# EAGLE design ublisterred_vow (EAGLE 9.6.2)
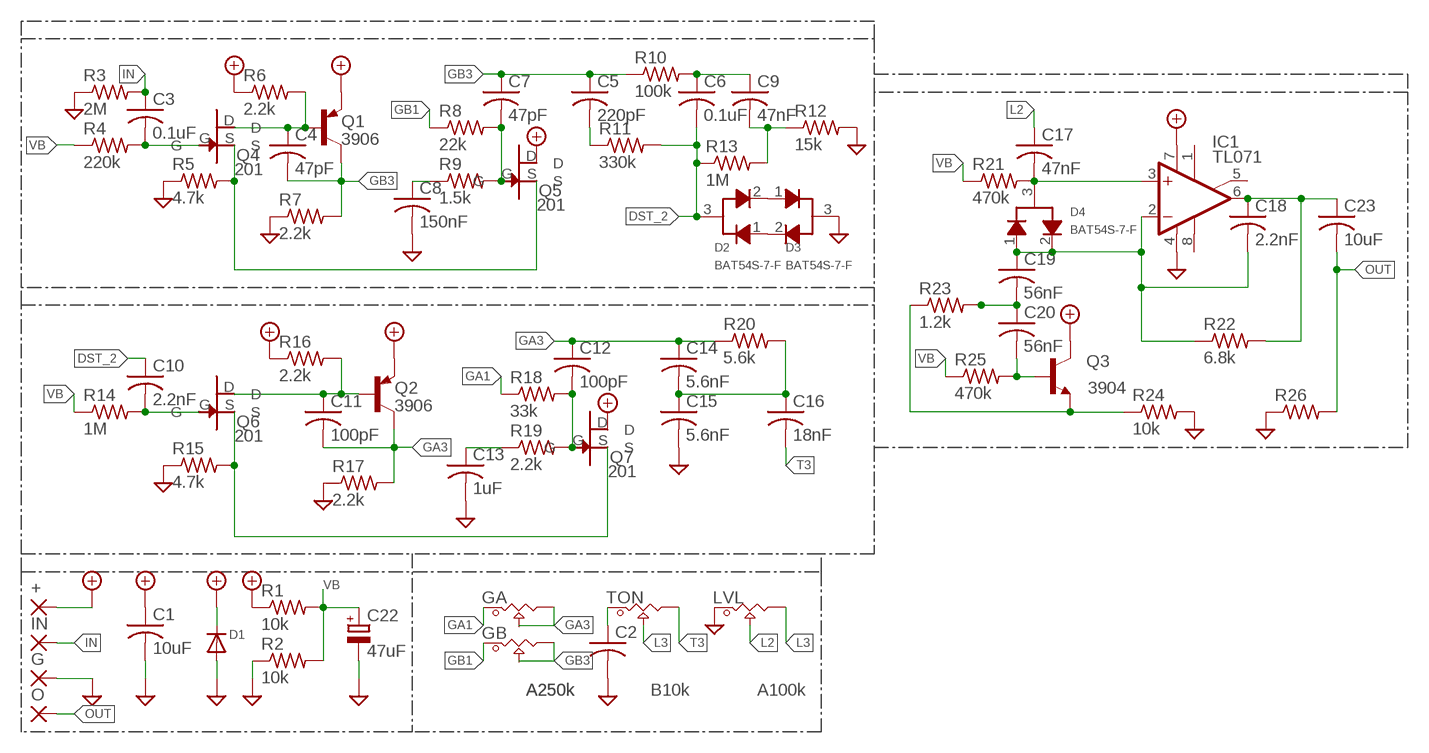
[diagram p0: schematic, sheet 1]

## Parts
+  SMD2  [SMD1,27-2,54]
C1  10uF  C-USC1206  [C1206]
C2  C-USC0603  [C0603]
C3  0.1uF  C-USC0603  [C0603]
C4  47pF  C-USC0603  [C0603]
C5  220pF  C-USC0603  [C0603]
C6  0.1uF  C-USC0603  [C0603]
C7  47pF  C-USC0603  [C0603]
C8  150nF  C-USC0603  [C0603]
C9  47nF  C-USC0603  [C0603]
C10  2.2nF  C-USC0603  [C0603]
C11  100pF  C-USC0603  [C0603]
C12  100pF  C-USC0603  [C0603]
C13  1uF  C-USC0603  [C0603]
C14  5.6nF  C-USC0603  [C0603]
C15  5.6nF  C-USC0603  [C0603]
C16  18nF  C-USC0603  [C0603]
C17  47nF  C-USC0603  [C0603]
C18  2.2nF  C-USC0603  [C0603]
C19  56nF  C-USC0603  [C0603]
C20  56nF  C-USC0603  [C0603]
C22  47uF  C-POL_TANTALUM-2917(7343-METRIC)  [CAPMP7343X310N]
C23  10uF  C-USC1206  [C1206]
D1  DIODESOD-123  [SOD-123]
D2  BAT54S-7-F  [SOT23-3]
D3  BAT54S-7-F  [SOT23-3]
D4  BAT54S-7-F  [SOT23-3]
G  SMD2  [SMD1,27-2,54]
GA  A250k  POT_9MM_SMD  [POT_9MM_SMD]
GB  A250k  POT_9MM_SMD  [POT_9MM_SMD]
IC1  TL071  TL071D  [SO08]
IN  SMD2  [SMD1,27-2,54]
LVL  A100k  POT_9MM_SMD  [POT_9MM_SMD]
O  SMD2  [SMD1,27-2,54]
Q1  3906  MMBT3906LT1G  [SOT23-3]
Q2  3906  MMBT3906LT1G  [SOT23-3]
Q3  3904  MMBT3904LT1G  [SOT23-3]
Q4  201  MMBFJ201  [MMBFJ201]
Q5  201  MMBFJ201  [MMBFJ201]
Q6  201  MMBFJ201  [MMBFJ201]
Q7  201  MMBFJ201  [MMBFJ201]
R1  10k  R-US_R0603  [R0603]
R2  10k  R-US_R0603  [R0603]
R3  2M  R-US_R0603  [R0603]
R4  220k  R-US_R0603  [R0603]
R5  4.7k  R-US_R0603  [R0603]
R6  2.2k  R-US_R0603  [R0603]
R7  2.2k  R-US_R0603  [R0603]
R8  22k  R-US_R0603  [R0603]
R9  1.5k  R-US_R0603  [R0603]
R10  100k  R-US_R0603  [R0603]
R11  330k  R-US_R0603  [R0603]
R12  15k  R-US_R0603  [R0603]
R13  1M  R-US_R0603  [R0603]
R14  1M  R-US_R0603  [R0603]
R15  4.7k  R-US_R0603  [R0603]
R16  2.2k  R-US_R0603  [R0603]
R17  2.2k  R-US_R0603  [R0603]
R18  33k  R-US_R0603  [R0603]
R19  2.2k  R-US_R0603  [R0603]
R20  5.6k  R-US_R0603  [R0603]
R21  470k  R-US_R0603  [R0603]
R22  6.8k  R-US_R0603  [R0603]
R23  1.2k  R-US_R0603  [R0603]
R24  10k  R-US_R0603  [R0603]
R25  470k  R-US_R0603  [R0603]
R26  R-US_R0603  [R0603]
TON  B10k  POT_9MM_SMD  [POT_9MM_SMD]

## Nets
+9V: +.1(P) C1.1 D1.C IC1.7(V+) Q1.2(E) Q2.2(E) Q3.3(C) Q5.D Q7.D R1.1 R6.1 R16.1
DST_2: C6.2 C10.1 D2.3 R11.2 R13.1
GA1: GA.1 R18.1
GA3: C11.2 C12.1 C14.1 GA.2 GA.3 Q2.3(C) R17.2 R20.1
GB1: GB.1 R8.1
GB3: C4.2 C5.1 C7.1 GB.2 GB.3 Q1.3(C) R7.2 R10.1
GND: C1.2 C2.2 C8.2 C13.2 C15.2 C22.2(-) D1.A D3.3 G.1(P) IC1.4(V-) LVL.1 R2.1 R3.1 R5.1 R7.1 R12.2 R15.1 R17.1 R24.2 R26.1
IN: C3.1 IN.1(P) R3.2
L2: C17.1 LVL.2
L3: LVL.3 TON.2
N$1: C4.1 Q1.1(B) Q4.D R6.2
N$2: C3.2 Q4.G R4.2
N$3: Q4.S Q5.S R5.2
N$4: C7.2 Q5.G R8.2 R9.2
N$5: C2.1 TON.1
N$6: C8.1 R9.1
N$7: C5.2 R11.1
N$8: C6.1 C9.1 R10.2
N$9: C10.2 Q6.G R14.2
N$10: C9.2 R12.1 R13.2
N$11: D2.2 D3.1
N$12: D2.1 D3.2
N$13: Q6.S Q7.S R15.2
N$14: C11.1 Q2.1(B) Q6.D R16.2
N$15: C12.2 Q7.G R18.2 R19.2
N$16: C13.1 R19.1
N$17: C14.2 C15.1 C16.1 R20.2
N$18: C17.2 D4.3 IC1.3(+IN) R21.2
N$19: C18.2 C19.1 D4.1 D4.2 IC1.2(-IN) R22.1
N$20: C18.1 C23.1 IC1.6(OUT) R22.2
N$21: C19.2 C20.1 R23.2
N$22: C20.2 Q3.1(B) R25.2
N$23: Q3.2(E) R23.1 R24.1
OUT: C23.2 O.1(P) R26.2
T3: C16.2 TON.3
VB: C22.1(+) R1.2 R2.2 R4.1 R14.1 R21.1 R25.1
Unconnected: IC1.1(ON1) IC1.5(ON2) IC1.8(OPT)

## Library data of the parts
+ G IN O = wirepad:SMD2: SMD PAD
C1-C20 C23 = adafruit:C-US: CAPACITOR, American symbol
C22 = Capacitor:C-POL: Capacitor Polarised - Generic; CATEGORY: Capacitor
D1 = adafruit:DIODE: Diode SMADIODE - SMA Surface Mount Package 20V 1A Schottky Diode Digikey: 641-1014-6-ND DO-1N4148 - Through Hole Small Current Diode SOD-123 20V 1 A (.5mV Vf) Schottky Diode - Digikey: MBRX120TPMSCT-ND SOD-323 10V 570mA (.38mV Vf, 3ns) Schottky Diode - Digikey: ZLLS410CT-ND SOD-523 30V 30mA Schottky Diode (RB751S-40TE61) - Digikey: RB751S-40TE61CT-ND SOT23-R/W - SOT23 Package (R = Solder Paste/Reflow Ovens, W = Hand-Soldering) BAT54Film 40V 300mA - Digikey: 497-7162-1-ND
D2-D4 = Diodes:BAT54S-7-F: DIODE ARRAY SCHOTTKY 30V SOT23-3 Manufacturer's datasheet <https://www.diodes.com/assets/Datasheets/ds11005.pdf>; CREATED_BY: PCBLayout.com; DIGIKEY_PART_NUMBER: BAT54S-FDITR-ND; MANUFACTURER: Diodes Incorporated; MPN: BAT54S-7-F; PACKAGE: SOT-23
GA GB LVL TON = Potentiometers_SMD:POT_9MM_SMD
IC1 = linear:TL071: OP AMP
Q1 Q2 = Transistor:MMBT3906LT1G: TRANS PNP 40V 0.2A SOT23 Manufacturer's datasheet <https://www.onsemi.com/pub/Collateral/MMBT3906LT1-D.PDF>; CREATED_BY: PCBLayout.com; DIGIKEY_PART_NUMER: MMBT3906LT1GOSTR-ND; MANUFACTURER: ON Semiconductor; MPN: MMBT3906LT1G; PACKAGE: SOT-23
Q3 = Transistor:MMBT3904LT1G: TRANS NPN 40V 0.2A SOT23 Manufacturer's datasheet <https://www.onsemi.com/pub/Collateral/MMBT3904LT1-D.PDF>; CREATED_BY: PCBLayout.com; DIGIKEY_PART_NUMBER: MMBT3904LT1GOSTR-ND; MANUFACTURER: ON Semiconductor; MPN: MMBT3904LT1G; PACKAGE: SOT23-3
Q4-Q7 = SOT95P240X110-3N:MMBFJ201
R1-R26 = adafruit:R-US_: RESISTOR, American symbol

## Board
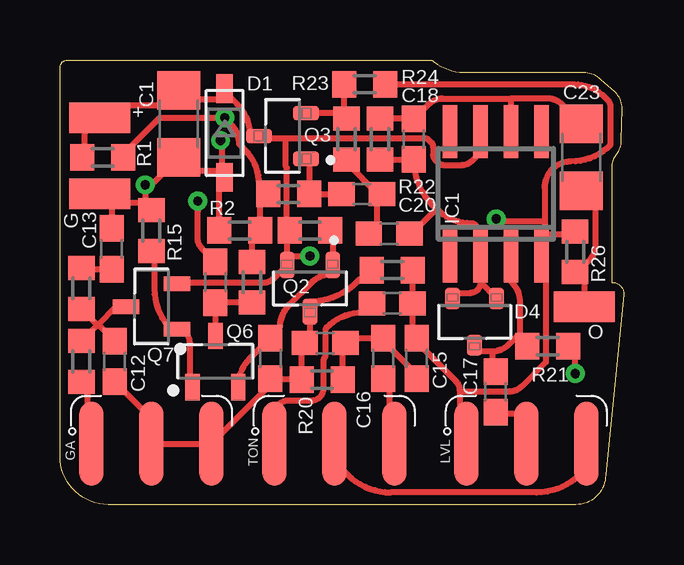
[diagram p1: board, top side]
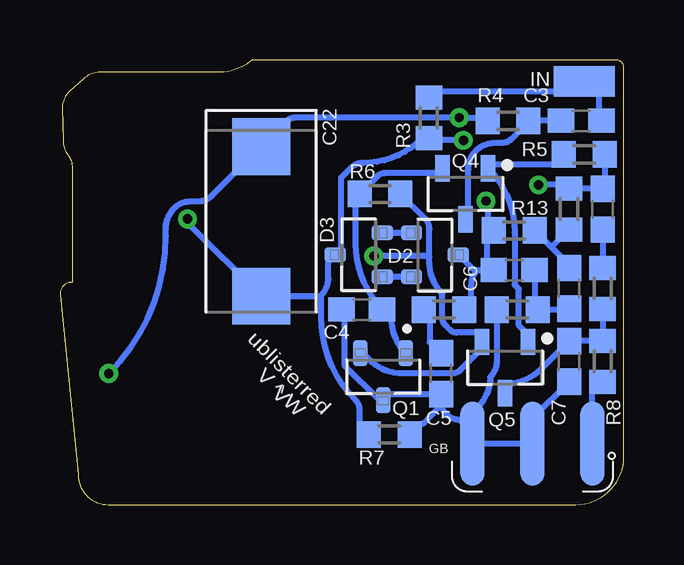
[diagram p2: board, bottom side, seen from below]

Size 23.5 x 18.54 mm. Coordinates in mm from the lower left corner, seen from the top.
Outline: 22.99,9.27 arc-90 23.5,8.76 22.73,1.24 arc-90 21.5,0 2,0 arc-90 0,2 0,18.22 arc-90 0.32,18.54 15.38,18.54 arc-39 15.58,18.47 arc39 16.83,18.03 21.81,18.03 arc-45 22.52,17.74 23.11,17.21 arc-45 23.41,16.51 23.37,15.19 arc-37 23.17,14.59 arc37 22.99,14.05 22.99,9.27
Copper layers (1*16): Top 0.035mm / dielectric 1.5mm / Bottom 0.035mm
Design rules "default *": minimum track width 6mil, minimum drill 0.35mm, track to track 6mil, track to pad 6mil, pad to pad 6mil, via to via 6mil, smd to smd 6mil, copper to edge 10mil, drill to drill 6mil, minimum pad ring 10mil, minimum via ring 8mil, stop-mask expansion 4mil, vias tented up to drill 0mil, thermal gap 10mil

### Footprints (pad centres in the part's own frame; a part is rotated, then mirrored left to right if it is on the bottom)
SMD1,27-2,54 = smd 1.27 x 2.54: 1 0,0
C1206 = smd 1.6 x 1.8: 1 -1.4,0; 2 1.4,0
C0603 = smd 1.1 x 1: 1 -0.85,0; 2 0.85,0
CAPMP7343X310N = smd 2.368 x 2.404: 1 -3.121,0; 2 3.121,0
SOD-123 = smd 1.2 x 0.7: A 1.85,0; C -1.85,0
SOT23-3 = smd 0.63 x 0.9: 1 -0.915,-0.975; 2 0.915,-0.975; 3 0,0.975
POT_9MM_SMD = smd 0.991 x 3.505: 1 -2.5,0; 2 0,0; 3 2.5,0
SO08 = smd 0.6 x 2.2: 1 -1.905,-2.6; 2 -0.635,-2.6; 3 0.635,-2.6; 4 1.905,-2.6; 5 1.905,2.6; 6 0.635,2.6; 7 -0.635,2.6; 8 -1.905,2.6
SOT23-3' = smd 0.62 x 1.1: 1 -0.95,-0.975; 2 0.95,-0.975; 3 0,0.975
MMBFJ201 = smd 1.099 x 0.602: D -1.065,-0.95; G 1.065,0; S -1.065,0.95
R0603 = smd 1 x 1.1: 1 -0.85,0; 2 0.85,0

### Placement (x,y rotation side)
+  1.65,16.13 90 top
C1  4.95,15.88 270 top
C2  13.84,8.38 0 top
C3  1.78,16 180 bottom
C4  10.92,8.13 180 bottom
C5  7.62,5.46 90 bottom
C6  4.57,9.78 180 bottom
C7  2.29,5.97 90 bottom
C8  0.89,12.32 90 bottom
C9  2.29,9.02 90 bottom
C10  6.48,9.27 270 top
C11  8.76,6.1 270 top
C12  2.29,5.97 90 top
C13  2.16,10.67 90 top
C14  11.05,6.73 0 top
C15  14.86,6.1 90 top
C16  13.46,6.1 270 top
C17  18.16,4.7 90 top
C18  14.73,15.24 270 top
C19  13.72,11.3 180 top
C20  12.57,12.95 180 top
C22  15.11,11.81 270 bottom
C23  21.72,14.48 270 top
D1  6.86,15.49 270 top
D2  7.87,10.41 270 bottom
D3  11.05,10.41 90 bottom
D4  17.27,7.62 180 top
G  1.65,12.95 90 top
GA  3.81,2.54 0 top
GB  3.81,2.54 180 bottom
IC1  18.16,12.95 0 top
IN  1.65,17.65 90 bottom
LVL  19.43,2.54 0 top
O  21.84,8.26 270 top
Q1  3906  [SOT23-3']  10.03,5.33 180 bottom
Q2  3906  [SOT23-3']  10.41,9.02 180 top
Q3  3904  [SOT23-3']  9.27,15.37 90 top
Q4  6.6,12.95 270 bottom
Q5  4.95,5.71 270 bottom
Q6  6.48,5.97 90 top
Q7  3.81,8.26 180 top
R1  1.78,14.48 0 top
R2  7.49,11.43 0 top
R3  8.13,16.13 90 bottom
R4  4.83,16 0 bottom
R5  1.65,14.61 180 bottom
R6  10.16,12.95 180 bottom
R7  9.78,2.92 0 bottom
R8  0.89,5.97 90 bottom
R9  0.89,9.02 270 bottom
R10  4.45,8.13 0 bottom
R11  7.49,8.13 0 bottom
R12  2.29,12.32 90 bottom
R13  4.57,11.43 0 bottom
R14  8,9.27 270 top
R15  3.81,11.43 270 top
R16  10.41,11.43 0 top
R17  13.84,9.78 180 top
R18  0.89,5.97 90 top
R19  0.89,9.02 270 top
R20  10.92,5.21 0 top
R21  20.32,6.6 180 top
R22  13.34,15.24 90 top
R23  11.94,15.24 270 top
R24  12.7,17.53 0 top
R25  9.53,12.95 0 top
R26  21.46,10.54 270 top
TON  11.43,2.54 0 top

### Tracks (layer width: path | path; a pad name or v marks a point on that pad's centre or on a via)
+9V  (via drill 0.38)
  Top 0.254: Q2.2 9.46,11.33 R16.1 9.45,11.54 9.45,14.05 9.42,14.09 9.42,15.24 9.4,15.26 | Q7.D 4.92,9.25 8.46,9.25 arc45 8.91,9.44 Q2.2 | R1.1 1.02,14.57 1.02,15.49 +.1 2.16,16.64 4.32,16.64 C1.1 5.33,16.89 6.48,16.89 6.83,17.24 | D1.C 6.89,17.31 6.83,17.24 | 6.83,17.24 7.35,16.72 arc-45 7.92,15.37 Q3.3 8.3,15.26 9.4,15.26 | 9.4,15.26 15.31,15.26 15.47,15.09 arc-45 15.55,14.91 15.55,14.6 arc45 15.64,14.37 15.77,14.24 arc45 15.96,14.16 16.75,14.16 arc45 17.17,14.34 17.53,14.69 IC1.7 | Q2.2 9.46,10.25 9.58,10.36 v10.41,10.36
  Bottom 0.254: Q1.2 10.88,6.31 10.63,6.07 arc-45 9.22,5.48 7.12,5.48 arc-45 6.83,5.6 5.9,6.53 Q5.D 5.9,6.91 6.17,7.17 6.97,7.17 arc45 7.25,7.29 7.45,7.49 arc45 7.56,7.77 7.56,8.79 arc45 8.1,10.09 8.1,10.36 | 8.1,10.36 8.1,11.47 arc-45 8.29,11.94 R6.1 | 8.1,10.36 v10.41,10.36
DST_2  (via drill 0.38)
  Top 0.254: v5.75,12.65 5.75,12.23 5.74,12.22 5.74,11.11 arc45 5.91,10.69 C10.1
  Bottom 0.254: D2.3 6.38,9.9 arc-45 6.1,9.78 | 6.1,9.78 5.71,9.78 | 5.71,9.78 C6.2 | 5.71,9.78 5.71,11.14 R13.1 5.68,11.68 5.68,12.58 v5.75,12.65 | R11.2 6.35,8.42 6.35,9.17 arc45 6.1,9.78
GA1
  Top 0.254: GA.1 1.14,2.71 1.14,5.12 R18.1
GA3
  Top 0.254: C12.1 3.81,3.6 GA.2 GA.3 8.76,4.99 C11.2 10.03,5.25 R20.1 10.07,6.6 C14.1 10.41,6.95 Q2.3 10.41,8.47 arc45 12.37,9.28 12.49,9.4 12.61,9.4 R17.2
GB1
  Bottom 0.254: GB.1 1.31,4.7 R8.1
GB3
  Bottom 0.254: C7.1 3.81,3.6 GB.2 GB.3 | C5.1 9.78,4.61 Q1.3 10.19,4.36 11.64,5.81 11.64,8 C4.2 | GB.3 6.31,2.88 6.31,3.85 6.09,4.07 arc-45 5.57,5.32 arc-45 5.29,5.98 R10.1 | GB.3 6.31,3.01 6.83,3.53 arc90 7.62,4.32 C5.1 | R7.2 8.51,3.34 arc-45 8.3,3.43 7.56,4.17 7.62,4.23 C5.1
GND  (via drill 0.38)
  Top 0.254: C13.2 2.16,12.45 G.1 2.03,12.57 3.3,12.57 3.6,12.28 R15.1 3.56,12.53 v3.56,13.34 arc45 4,13.52 C1.2 5.53,13.9 6.6,13.9 D1.A | R17.1 C2.2 14.69,7.11 C15.2 14.86,6.79 16.47,5.17 arc-45 16.66,4.72 | 16.66,4.72 16.66,4.17 16.93,3.9 LVL.1 | R2.1 6.64,13.43 D1.A | R26.1 21.34,11.26 20.19,11.26 | 20.19,11.26 20.07,11.26 IC1.4 20.07,9.46 20.25,9.28 20.25,5.94 19.24,4.93 arc-45 18.73,4.72 16.66,4.72 | D1.A 6.73,13.77 6.73,15.14 v6.69,15.19 | 20.19,11.81 20.19,13.22 arc-90 21.28,14.3 arc45 22.94,14.99 22.94,16.59 arc45 22.82,16.87 22.68,17 arc45 21.43,17.53 R24.2 | 20.19,11.81 20.19,11.26 | 20.19,11.81 18.29,11.81 v18.18,11.91
  Bottom 0.254: R7.1 11.01,3.3 11.01,3.97 arc-45 11.15,4.32 arc45 12.61,7.84 12.61,8.73 | v18.18,11.91 18.18,11.76 C22.2 12.65,8.69 12.61,8.73 | R5.1 0.8,13.26 C8.2 R12.2 2.45,13.34 v3.56,13.34 | v6.69,15.19 8.04,15.19 8.11,15.26 R3.1 8.39,15.28 arc45 10.9,14.24 arc-45 11.36,14.05 11.76,13.65 arc-45 11.79,13.58 11.79,10.65 D3.3 12.31,10.12 12.31,9.44 arc45 12.6,8.74 12.61,8.73
IN
  Bottom 0.254: C3.1 1.02,16.09 1.02,17.53 1.14,17.65 IN.1 2.07,17.23 7.87,17.23 R3.2
L2
  Top 0.254: C17.1 18.2,3.81 19.43,3.81 LVL.2
L3
  Top 0.254: TON.2 11.7,2.27 11.7,1.52 11.98,1.25 arc45 13.77,0.51 19.86,0.51 arc45 21.66,1.25 21.93,1.52 LVL.3
N$1
  Bottom 0.254: Q1.1 9.1,6.33 arc45 9.69,7.75 C4.1 10.07,8.18 arc45 11.18,10.86 11.18,12.66 R6.2 10.26,13.7 arc45 9.98,13.82 7.75,13.82 Q4.D
N$2
  Bottom 0.254: R4.2 3.96,15.98 | 3.96,15.98 3.95,15.97 3.92,16 C3.2 | Q4.G 6.48,12.01 6.48,13.98 arc90 5.38,15.09 5.11,15.09 arc-45 4.67,15.27 3.96,15.98
N$3
  Bottom 0.254: Q5.S 4,7.09 4.37,7.46 4.37,8.99 4.55,9.16 4.55,11.36 arc-45 Q4.S 5.47,14.21 2.9,14.21 R5.2
N$4
  Bottom 0.254: Q5.G 4.95,5.03 arc-45 3.45,5.65 C7.2 R8.2 R9.2
N$5
  Top 0.254: C2.1 12.63,8.02 arc45 11.11,7.39 arc45 11.07,7.29 11.07,6.18 arc45 10.98,5.97 10.98,4.84 arc-90 10.48,4.34 9.53,4.34 arc90 8.93,3.74 TON.1
N$6
  Bottom 0.254: C8.1 R9.1
N$7
  Bottom 0.254: C5.2 8.09,6.78 8.09,7.87 R11.1
N$8
  Bottom 0.254: C6.1 3.72,8.26 R10.2 2.33,8.13 C9.1
N$9
  Top 0.254: R14.2 C10.2 Q6.G
N$10
  Bottom 0.254: C9.2 2.29,9.99 3.07,10.78 | 3.07,10.78 R13.2 | R12.1 2.98,10.78 3.07,10.78
N$11
  Bottom 0.254: D2.2 D3.1
N$12
  Bottom 0.254: D2.1 D3.2
N$13
  Top 0.254: Q6.S 5.4,5.03 5.4,6.78 arc90 Q7.S 4.63,7.3 arc-45 3.94,8.98 3.94,10.45 R15.2
N$14
  Top 0.254: Q6.D arc-45 7.93,6.11 C11.1 9.14,7.33 arc-45 9.57,8.36 10.44,9.23 arc-45 11.36,9.61 Q2.1 11.36,11.33 R16.2
N$15
  Top 0.254: 1.59,7.52 2.33,8.26 Q7.G | C12.2 1.63,7.47 | 1.63,7.47 1.59,7.52 | R18.2 1.59,7.52 | R19.2 1.58,7.47 1.63,7.47
N$16
  Top 0.254: R19.1 0.94,9.82 C13.1
N$17
  Top 0.254: R20.2 11.77,6.6 C14.2 12.11,6.95 C16.1 13.46,6.82 14.86,5.42 C15.1
N$18
  Top 0.254: IC1.3 18.8,9.31 arc-45 19.16,8.42 19.16,6.91 R21.2 19.05,7.03 18.68,6.66 arc-45 18.03,6.39 | 18.03,6.39 17.27,6.39 D4.3 | C17.2 18.03,5.68 18.03,6.39
N$19
  Top 0.254: R22.1 14.57,14.39 14.65,14.31 C18.2 arc45 15.52,12.49 15.69,12.33 | 17.53,9.26 IC1.2 17.38,10.5 17.38,11.48 arc90 17.13,11.73 arc-45 15.69,12.33 | 17.53,9.26 arc-90 17.1,8.83 16.59,8.83 D4.2 | D4.1 17.53,9.26 | 15.69,12.33 14.66,11.3 C19.1
N$20
  Top 0.254: R22.2 C18.1 14.76,16.09 15.37,16.7 arc-45 15.93,16.93 18.8,16.93 | C23.1 20.9,16.7 arc45 20.33,16.93 18.8,16.93 | IC1.6 18.8,16.93
N$21
  Top 0.254: R23.2 11.94,14.26 13.25,12.95 C20.1 13.21,12.74 13.21,11.64 C19.2
N$22
  Top 0.254: Q3.1 10.38,14.29 R25.2 C20.2
N$23
  Top 0.254: Q3.2 11.58,16.32 11.81,16.09 R23.1 11.85,16.18 R24.1
OUT
  Top 0.254: O.1 21.84,9.31 R26.2 21.54,9.69 22.11,10.26 arc45 22.29,10.71 22.29,12.5 C23.2
T3
  Top 0.254: TON.3 13.72,2.75 13.72,4.99 C16.2
VB  (via drill 0.38)
  Top 0.254: R1.2 2.63,14.61 4.15,16.13 v6.86,16.13 7.12,15.86 arc-45 7.47,15.04 7.71,14.79 arc-45 8.29,13.38 8.29,13.34 R25.1 8.34,12.62 R2.2 8,11.09 R14.1 | v21.46,5.46 21.46,6.31 R21.1
  Bottom 0.254: R4.1 5.8,16.13 v6.86,16.13 12,16.13 12.22,16.13 13.74,16.13 arc-45 14.03,16.01 C22.1 17.16,12.88 arc45 17.75,12.64 18.08,12.64 arc-45 18.73,12.37 arc-45 19.09,11.5 19.09,11.2 arc45 v21.46,5.46

### Text on the board
bPlace: ublisterred | V | V ^ W